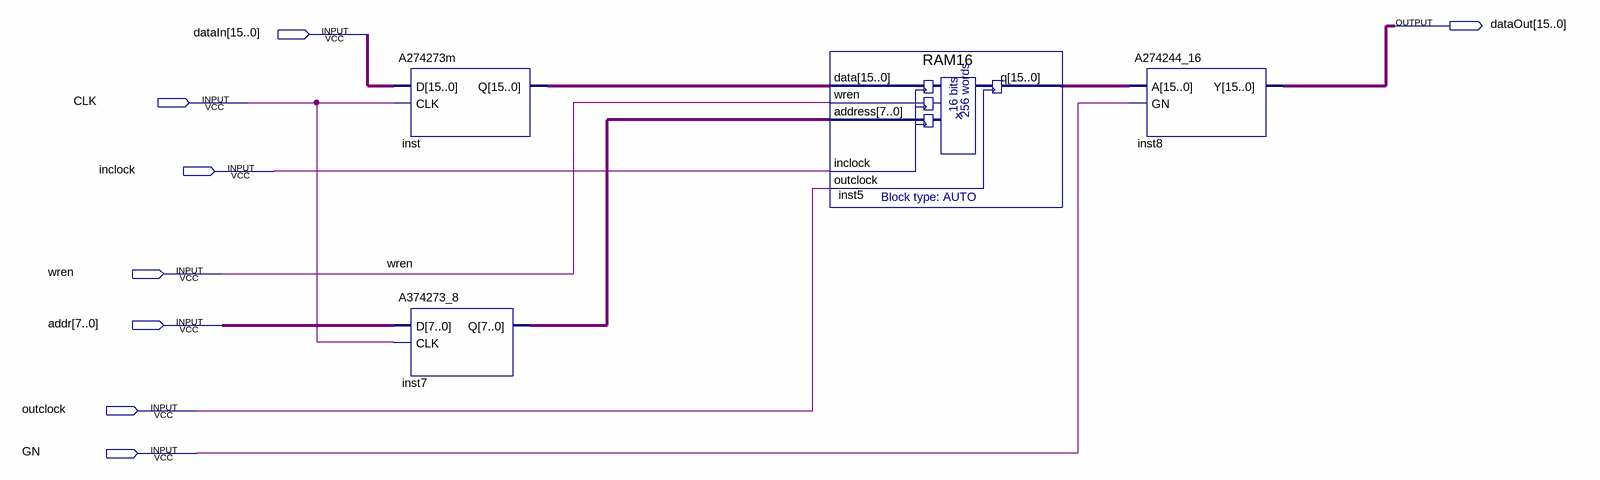
[diagram p0: schematic sheet]
// Quartus schematic A3.bdf as structural Verilog: 4 symbols, 8 pins
module A3 (
  input  [15:0] dataIn,
  input  CLK,
  input  inclock,
  input  wren,
  input  [7:0] addr,
  input  outclock,
  input  GN,
  output [15:0] dataOut
);

  wire [7:0] inst7_q;
  wire [15:0] inst5_q, inst_q;

  A274273m inst (.D(dataIn), .CLK(CLK), .Q(inst_q));
  A374273_8 inst7 (.D(addr), .CLK(CLK), .Q(inst7_q));
  RAM16 inst5 (.data(inst_q), .wren(wren), .address(inst7_q), .inclock(inclock), .outclock(outclock), .q(inst5_q));
  A274244_16 inst8 (.A(inst5_q), .GN(GN), .Y(dataOut));
endmodule
